# EAGLE design programmer (EAGLE 7.5.0)
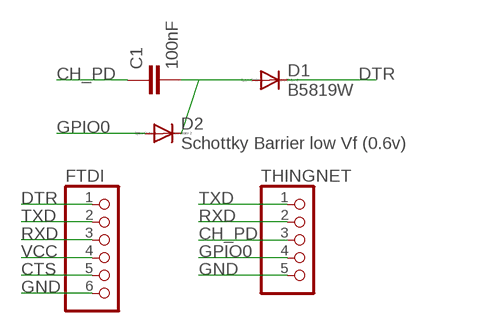
[diagram p0: schematic, sheet 1]

## Parts
C1  100nF  C-EU025-024X044  [C025-024X044]
D1  B5819W  DIODE-D-5  [D-5]
D2  Schottky Barrier low Vf (0.6v)  DIODE-D-5  [D-5]
FTDI  PINHD-1X6  [1X06]
THINGNET  PINHD-1X5  [1X05]

## Nets
CH_PD: C1.1 THINGNET.3
CTS: FTDI.5
DTR: D1.C FTDI.1
GND: FTDI.6 THINGNET.5
GPIO0: D2.A THINGNET.4
N$1: C1.2 D1.A D2.C
RXD: FTDI.3 THINGNET.2
TXD: FTDI.2 THINGNET.1
VCC: FTDI.4

## Library data of the parts
C1 = rcl:C-EU: CAPACITOR, European symbol
D1 D2 = diode:DIODE-: DIODE
FTDI = pinhead:PINHD-1X6: PIN HEADER
THINGNET = pinhead:PINHD-1X5: PIN HEADER

## Board
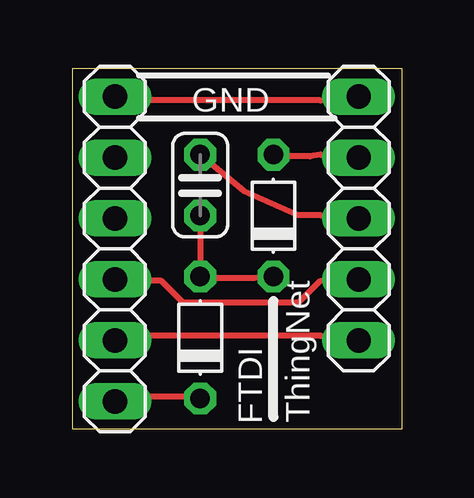
[diagram p1: board, top side]

Size 13.75 x 15 mm. Coordinates in mm from the lower left corner, seen from the top.
Outline: 0,0 13.75,0 13.75,15 0,15 0,0
Copper layers (1*16): Top 0.035mm / dielectric 1.5mm / Bottom 0.035mm
Design rules "SeeedStudio_2layer_DRU_no_angle_20140221": minimum track width 6mil, minimum drill 12mil, track to track 6mil, track to pad 6mil, pad to pad 6mil, via to via 6mil, smd to smd 0mil, copper to edge 10mil, drill to drill 10mil, minimum pad ring 10mil, minimum via ring 6mil, stop-mask expansion 2mil, vias tented up to drill 100mil, thermal gap 10mil

### Footprints (pad centres in the part's own frame; a part is rotated, then mirrored left to right if it is on the bottom)
C025-024X044 = drill 0.813 octagon: 1 -1.27,0; 2 1.27,0
D-5 = drill 0.813 octagon: A 2.54,0; C -2.54,0
1X06 = drill 1.016 long: 1 -6.35,0; 2 -3.81,0; 3 -1.27,0; 4 1.27,0; 5 3.81,0; 6 6.35,0
1X05 = drill 1.016 long: 1 -5.08,0; 2 -2.54,0; 3 0,0; 4 2.54,0; 5 5.08,0

### Placement (x,y rotation side)
C1  5.33,10.16 270 top
D1  5.33,3.81 90 top
D2  8.38,8.89 90 top
FTDI  1.78,7.5 90 top
THINGNET  11.94,8.77 90 top

### Tracks (layer width: path | path; a pad name or v marks a point on that pad's centre or on a via)
CH_PD
  Top 0.254: C1.1 7.16,9.91 9.42,8.91 10.34,8.91 THINGNET.3
DTR
  Top 0.254: D1.C 5.08,1.37 2.11,1.37 FTDI.1
GND
  Top 0.254: FTDI.6 2.11,13.69 10.34,13.69 THINGNET.5
GPIO0
  Top 0.254: D2.A 8.08,11.35 9.91,11.35 10.34,11.43 THINGNET.4
N$1
  Top 0.254: C1.2 D1.A 5.08,6.3 7.59,6.3 D2.C
RXD
  Top 0.254: FTDI.3 2.11,6.17 3.71,6.17 4.62,5.26 9.42,5.26 10.34,6.17 THINGNET.2
TXD
  Top 0.254: FTDI.2 2.11,3.89 10.34,3.89 THINGNET.1

### Text on the board
tNames: GND | ThingNet